# Altium project MobileRobot.PrjPcb
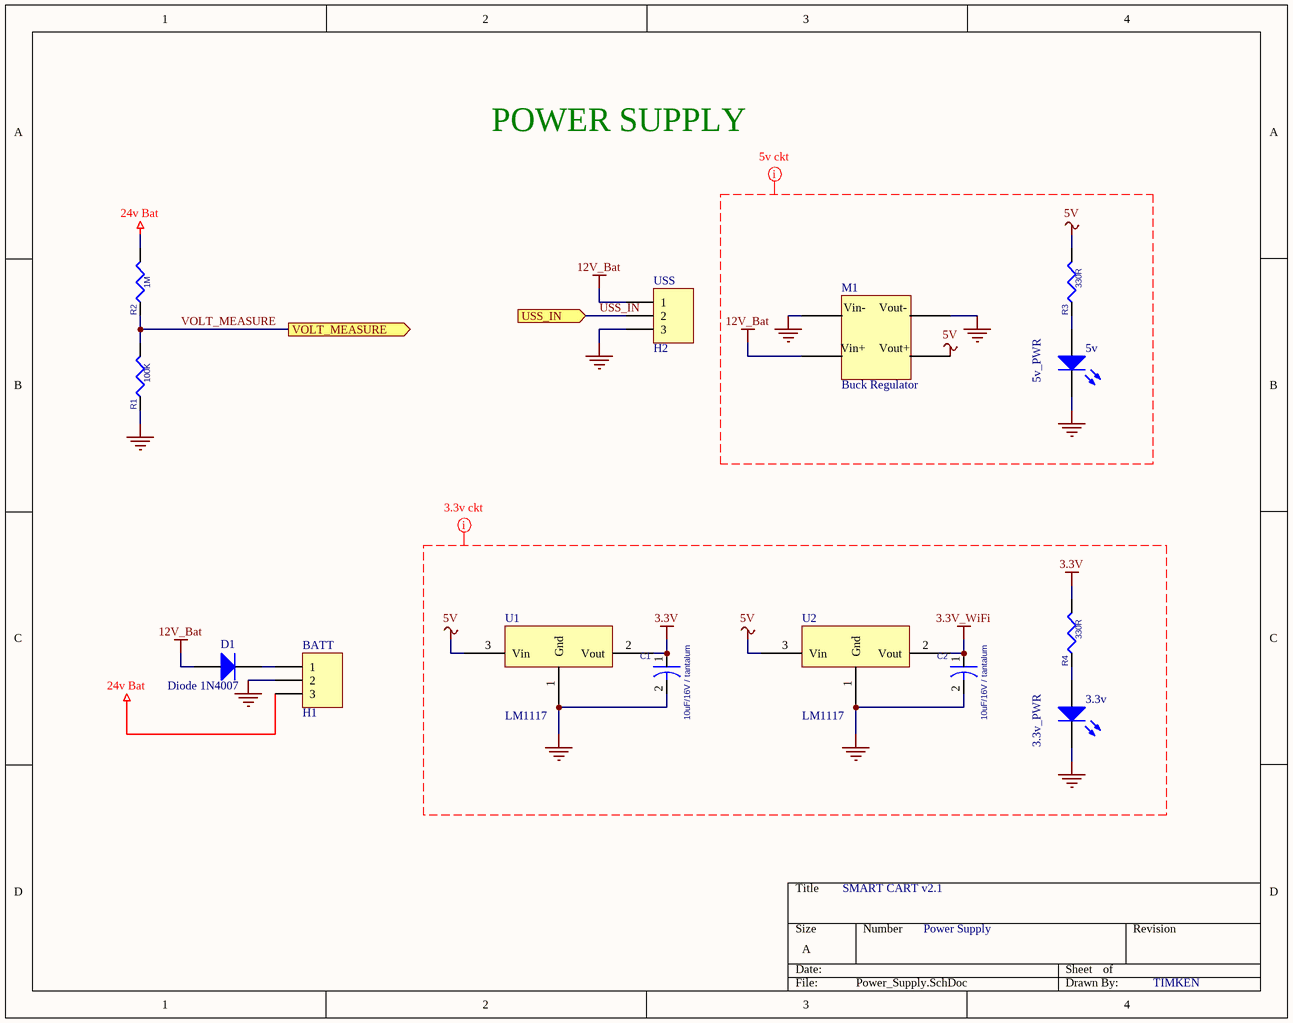
[diagram p0: Power_Supply.SchDoc]
7 sheets, 85 parts. Net scope: flat (ports and power ports of the same name join across sheets).
Board file: SmartCart_v2.1.PcbDoc
Sheets:
  Power_Supply.SchDoc
  Microcontroller.SchDoc
  Level_Shifter.SchDoc
  Debug.SchDoc
  LCD.SchDoc
  Memory.SchDoc
  Wifi.SchDoc

## Sheet Power_Supply.SchDoc
size A; Author: TIMKEN; CompanyName: TCS ROBOTICS; DrawnBy: TIMKEN; SheetNumber: 1; SheetTotal: 7; ProjectName: SMART CART v2.1

### Parts
3.3v  3.3v_PWR  [LED_SMD]
5v  5v_PWR  [LED_SMD]
BATT  H1  [BATTERY_3PIN]
C1  10uF/16V / tantalum  [CAP_TANTALUM]
C2  10uF/16V / tantalum  [1210]
D1  Diode 1N4007  [D-IN4007]
M1  Buck Regulator  [BUCKREGULATOR]
R1  100K  [RES_SMD]
R2  1M  [RES_SMD]
R3  330R  [RES_SMD]
R4  330R  [RES_SMD]
U1  LM1117  [LM1117]
U2  LM1117  [LM1117]
USS  H2  [1x3_single - duplicate]

### Ports
USS_IN (in), VOLT_MEASURE (out)

### Nets
3.3V: C1.1 R4.2 U1.2(Vout)
3.3V_WiFi: C2.1 U2.2(Vout)
5V: M1.Vout+ R3.2 U1.3(Vin) U2.3(Vin)
12V_Bat: D1.1(A) M1.Vin+ USS.1
24v Bat: BATT.3 R2.2
GND_POWER: 3.3v.2(K) 5v.2(K) BATT.2 C1.2 C2.2 M1.Vin- M1.Vout- R1.1 U1.1(Gnd) U2.1(Gnd) USS.3
USS_IN: USS.2 ; port USS_IN
VOLT_MEASURE: R1.2 R2.1 ; port VOLT_MEASURE
Net3.3v_1: 3.3v.1(A) R4.1
Net5v_1: 5v.1(A) R3.1
NetBATT_1: BATT.1 D1.2(K)

### Layout directives
rule Power Plane Clearance [Clearance = 20mil]: 3.3V, 3.3V_WiFi, 5V, 12V_Bat, GND_POWER

### Notes on the sheet
- POWER SUPPLY
- Power Supply

### Library data of the parts
3.3v 5v = LED_SMD: Typical INFRARED GaAs LED_throughole; Published: 8-Jun-2000; LatestRevisionDate: 08-Jul-2005; LatestRevisionNote: Mech Layer 1 removed.; PackageReference: LED-0; Publisher: Altium Limited; PackageDescription: LED; 2 Leads
BATT = BATTERY_3PIN: Header, 3-Pin
C1 C2 = C_0: M P No: TPSB106K016R0500; Vendor: Digikey; Descr: CAP TANT 10UF 16V 10% 1210,0.138" L x 0.110" W (3.50mm x 2.80mm); V P No: 478-5230-6-ND; Footprint: C1210
D1 = Diode 1N4007: 1 Amp General Purpose Rectifier; Published: 8-Jun-2000; LatestRevisionDate: 17-Jul-2002; LatestRevisionNote: Re-released for DXP Platform.; DatasheetVersion: 1998; PackageVersion: Aug-1999; PackageReference: DO-41; Publisher: Altium Limited; PackageDescription: Diode, Axial; Body 5.2 x 2.7 mm (LxDia. max), Lead Dia. 0.86 mm (max); Code_JEDEC: DO-204-AL; ComponentLink1Description: Manufacturer Link; ComponentLink1URL: http://www.fairchildsemi.com/; ComponentLink2Description: Datasheet; ComponentLink2URL: http://www.fairchildsemi.com/ds/1N%2F1N4001.pdf
M1 = Regulator: buck regulator\; XilinxEquivalent: CB4CLE; FunctionalClass: Counter; SubClass: Binary; ClockTrigger: Rising; Enable: High; Loadable: True; Reset: Asynchronous; PortSize: 4; PortType: Single Pin Version; ArchiveName: GENERIC; VHDLIB_SIM: GENERIC_LIB; Published: 29-Jan-2004; Publisher: Altium Limited; LastRevisionNo: 1.00.00; HelpURL: CR0118 FPGA Generic Library Guide.pdf#page=130; ComponentLink1URL: CR0130 FPGA Counter Resource Usage.pdf#page=18; ComponentLink1Description: Core &Resource Usage
R1-R4 = RESISTOR: Vendor: Digikey; Descr: RES 10K OHM 1/2W 5% 0805 SMD; V P No: P10KADTR-ND; M P No: ERJ-P06J103V; FootPrint: 0.079" L x 0.049" W (2.00mm x 1.25mm)  (0805 (2012 Metric)  )
USS = Header 3: Header, 3-Pin; LatestRevisionDate: 17-Jul-2002; LatestRevisionNote: Re-released for DXP Platform.; Publisher: Altium Limited

## Sheet Microcontroller.SchDoc
size C; DrawnBy: TIMKEN; SheetNumber: 2; SheetTotal: 7
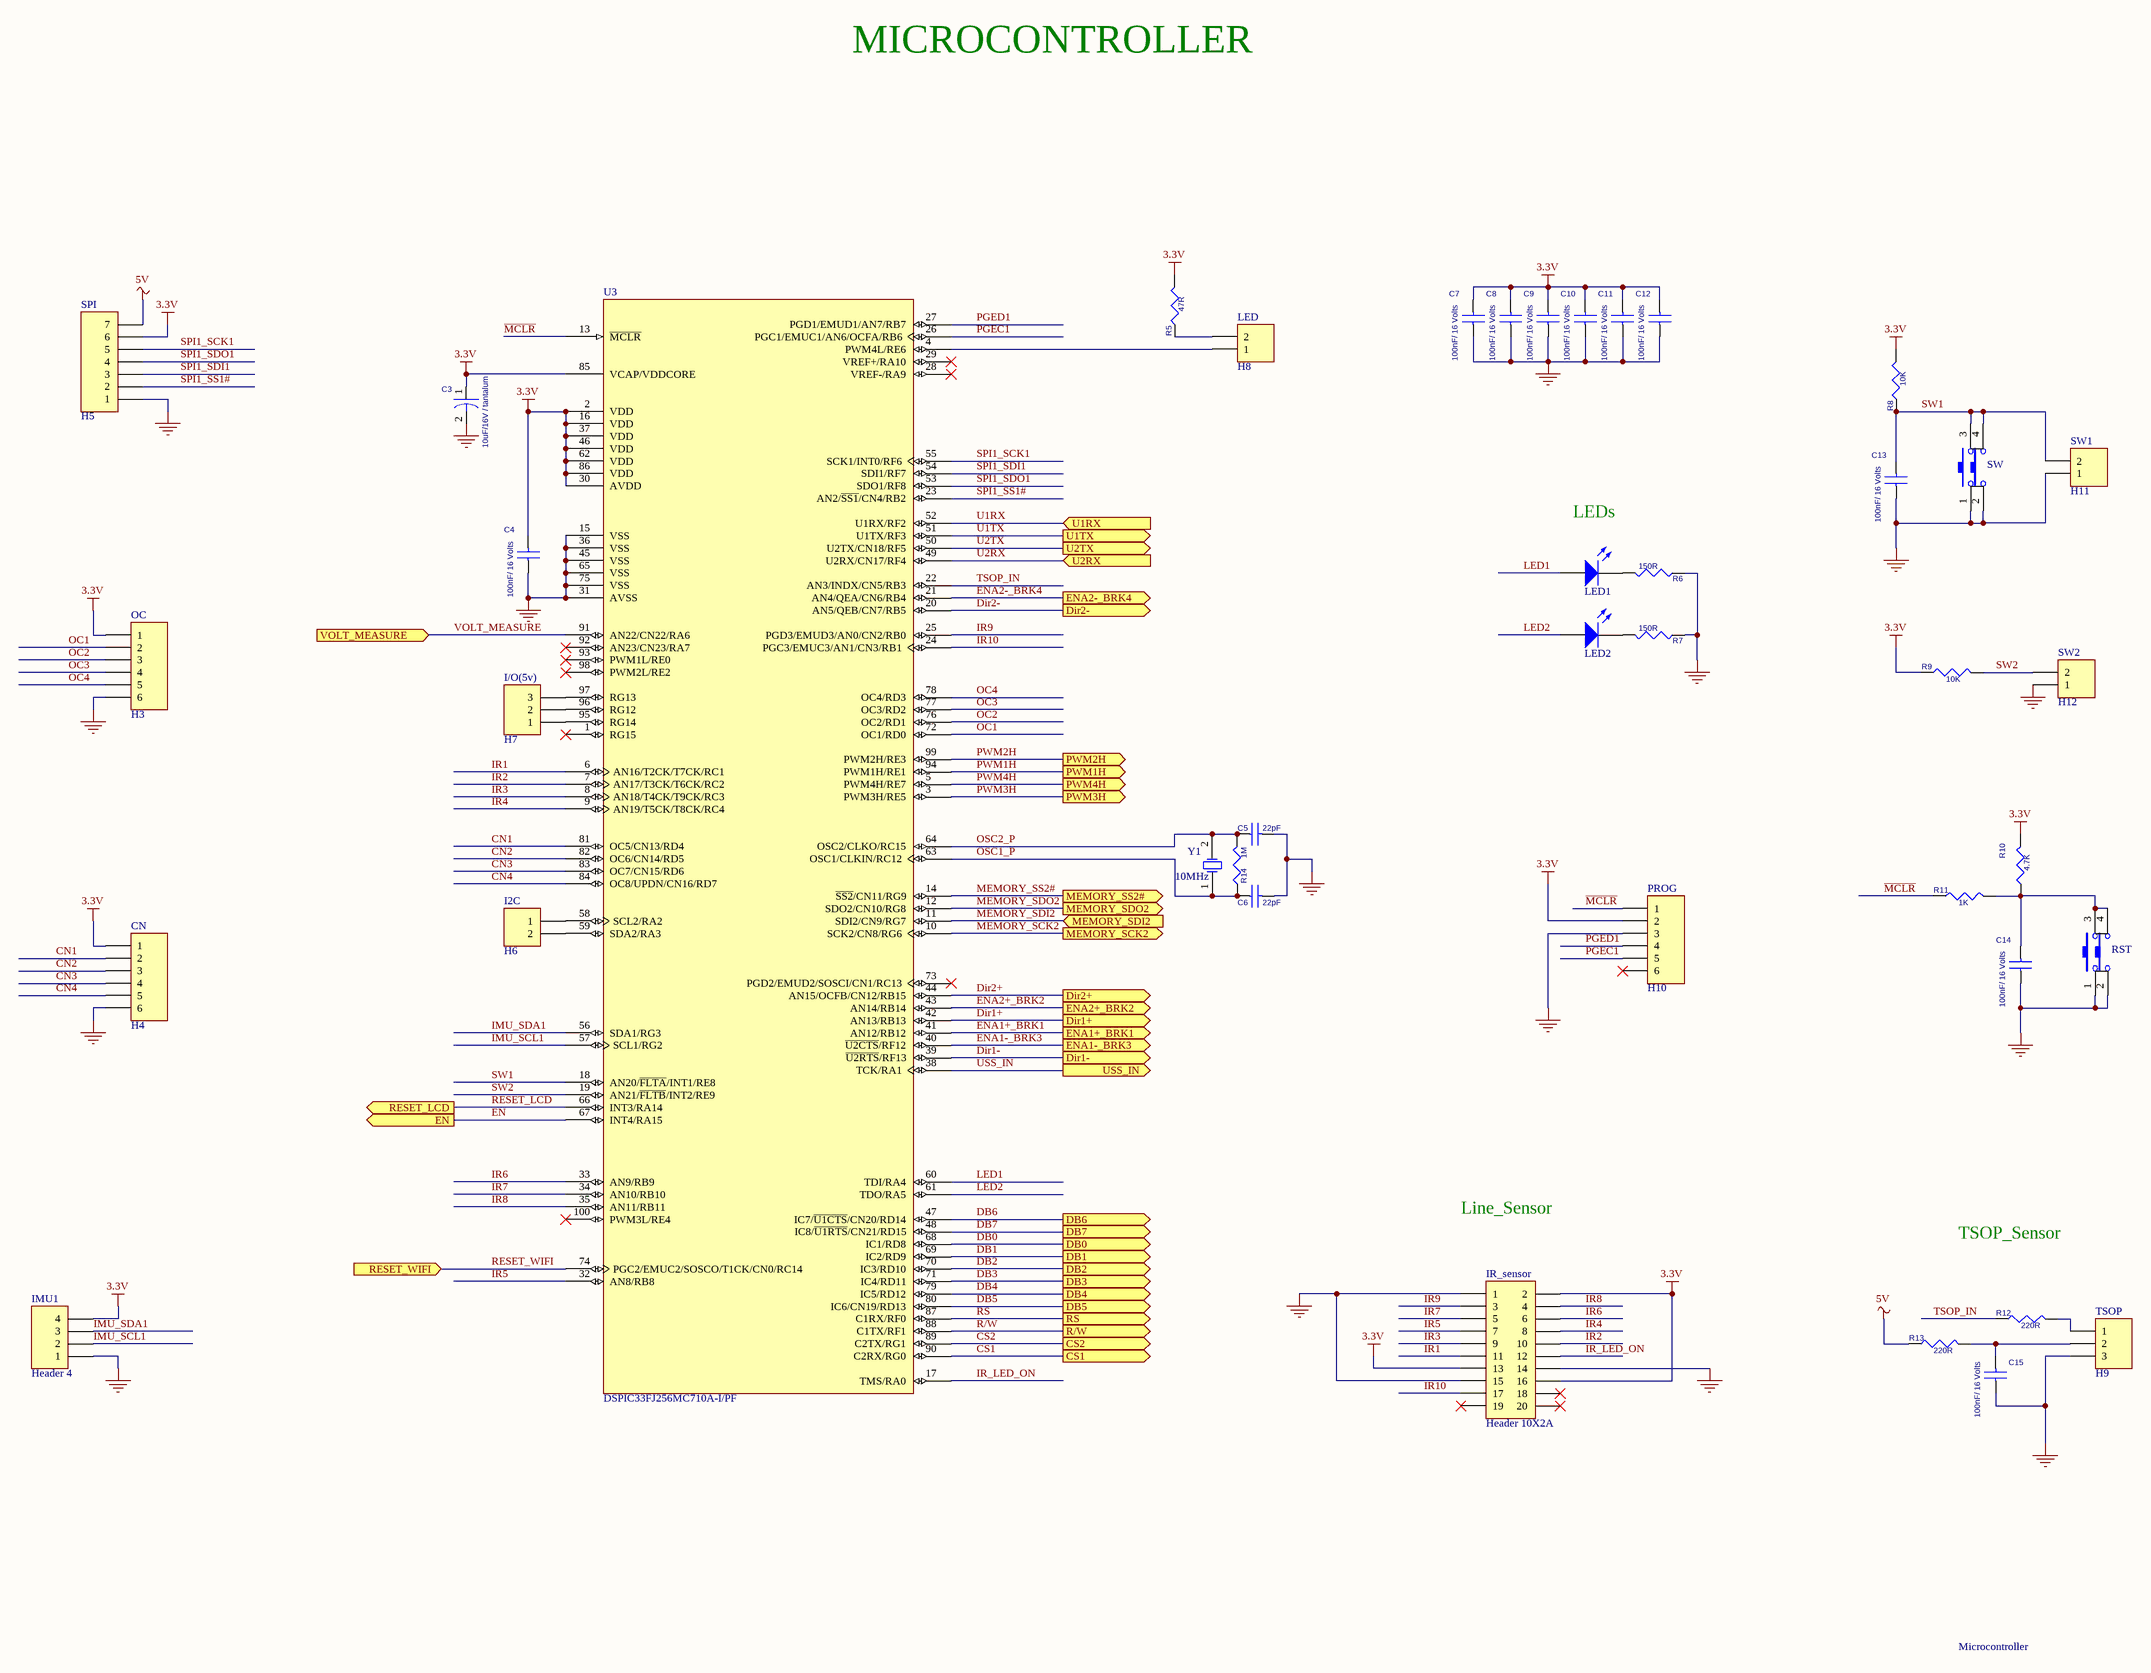
[diagram p1: Microcontroller.SchDoc]

### Parts
C3  10uF/16V / tantalum  [CAP_TANTALUM]
C4  100nF/ 16 Volts  [CAP_CERAMIC]
C5  22pF  [CAP_CERAMIC]
C6  22pF  [CAP_CERAMIC]
C7  100nF/ 16 Volts  [CAP_CERAMIC]
C8  100nF/ 16 Volts  [CAP_CERAMIC]
C9  100nF/ 16 Volts  [CAP_CERAMIC]
C10  100nF/ 16 Volts  [CAP_CERAMIC]
C11  100nF/ 16 Volts  [CAP_CERAMIC]
C12  100nF/ 16 Volts  [CAP_CERAMIC]
C13  100nF/ 16 Volts  [CAP_CERAMIC]
C14  100nF/ 16 Volts  [CAP_CERAMIC]
C15  100nF/ 16 Volts  [CAP_CERAMIC]
CN  H4  [1x6_single]
I2C  H6  [1x2_single]
I/O(5v)  H7  [1x3_single - duplicate]
IMU1  Header 4  [1x4_single]
IR_sensor  Header 10X2A  [10x2 row_ 2.54mm pitch]
LED  H8  [1x2_single]
LED1  LED1  [LED_SMD]  (value not drawn)
LED2  LED2  [LED_SMD]  (value not drawn)
OC  H3  [1x6_single]
PROG  H10  [1x6_single]
R5  47R  [RES_SMD]
R6  150R  [RES_SMD]
R7  150R  [RES_SMD]
R8  10K  [RES_SMD]
R9  10K  [RES_SMD]
R10  4.7K  [RES_SMD]
R11  1K  [RES_SMD]
R12  220R  [RES_SMD]
R13  220R  [RES_SMD]
R14  1M  [RES_SMD]
RST  SW-SMD  [SWITCH_SMD]  (value not drawn)
SPI  H5  [1x7_single]
SW  SW-SMD  [SWITCH_SMD]  (value not drawn)
SW1  H11  [1x2_single]
SW2  H12  [1x2_single]
TSOP  H9  [1x3_single - duplicate]
U3  DSPIC33FJ256MC710A-I/PF  [DSPIC33FJ256MC710-I/PF]
Y1  10MHz  [CRYSTAL_10MHZ]

### Ports
CS1 (out), CS2 (out), DB0 (out), DB1 (out), DB2 (out), DB3 (out), DB4 (out), DB5 (out), DB6 (out), DB7 (out), Dir1+ (out), Dir1- (out), Dir2+ (out), Dir2- (out), EN (out), ENA1+_BRK1 (out), ENA1-_BRK3 (out), ENA2+_BRK2 (out), ENA2-_BRK4 (out), MEMORY_SCK2 (out), MEMORY_SDI2 (in), MEMORY_SDO2 (out), MEMORY_SS2# (out), PWM1H (out), PWM2H (out), PWM3H (out), PWM4H (out), R/W (out), RESET_LCD (out), RESET_WIFI (in), RS (out), U1RX (in), U1TX (out), U2RX (in), U2TX (out), USS_IN (out), VOLT_MEASURE (in)

### Nets
3.3V: C3.1 C4.2 C7.2 C8.2 C9.2 C10.2 C11.2 C12.2 CN.1 IMU1.4 IR_sensor.2 IR_sensor.13 IR_sensor.16 OC.1 PROG.2 R5.2 R8.2 R9.1 R10.2 SPI.6 U3.2(VDD) U3.16(VDD) U3.30(AVDD) U3.37(VDD) U3.46(VDD) U3.62(VDD) U3.85(VCAP/VDDCORE) U3.86(VDD)
5V: R13.1 SPI.7
GND_POWER: C3.2 C4.1 C5.2 C6.2 C7.1 C8.1 C9.1 C10.1 C11.1 C12.1 C13.1 C14.1 C15.1 CN.6 IMU1.1 IR_sensor.1 IR_sensor.14 IR_sensor.15 OC.6 PROG.3 R6.1 R7.1 RST.1 RST.2 SPI.1 SW.1 SW.2 SW1.1 SW2.1 TSOP.3 U3.15(VSS) U3.31(AVSS) U3.36(VSS) U3.45(VSS) U3.65(VSS) U3.75(VSS)
CN1: CN.2 U3.81(OC5/CN13/RD4)
CN2: CN.3 U3.82(OC6/CN14/RD5)
CN3: CN.4 U3.83(OC7/CN15/RD6)
CN4: CN.5 U3.84(OC8/UPDN/CN16/RD7)
CS1: U3.90(C2RX/RG0) ; port CS1
CS2: U3.89(C2TX/RG1) ; port CS2
DB0: U3.68(IC1/RD8) ; port DB0
DB1: U3.69(IC2/RD9) ; port DB1
DB2: U3.70(IC3/RD10) ; port DB2
DB3: U3.71(IC4/RD11) ; port DB3
DB4: U3.79(IC5/RD12) ; port DB4
DB5: U3.80(IC6/CN19/RD13) ; port DB5
DB6: U3.47(IC7/~{U1CTS}/CN20/RD14) ; port DB6
DB7: U3.48(IC8/~{U1RTS}/CN21/RD15) ; port DB7
Dir1+: U3.42(AN13/RB13) ; port Dir1+
Dir1-: U3.39(~{U2RTS}/RF13) ; port Dir1-
Dir2+: U3.44(AN15/OCFB/CN12/RB15) ; port Dir2+
Dir2-: U3.20(AN5/QEB/CN7/RB5) ; port Dir2-
EN: U3.67(INT4/RA15) ; port EN
ENA1+_BRK1: U3.41(AN12/RB12) ; port ENA1+_BRK1
ENA1-_BRK3: U3.40(~{U2CTS}/RF12) ; port ENA1-_BRK3
ENA2+_BRK2: U3.43(AN14/RB14) ; port ENA2+_BRK2
ENA2-_BRK4: U3.21(AN4/QEA/CN6/RB4) ; port ENA2-_BRK4
IMU_SCL1: IMU1.2 U3.57(SCL1/RG2)
IMU_SDA1: IMU1.3 U3.56(SDA1/RG3)
IR1: IR_sensor.11 U3.6(AN16/T2CK/T7CK/RC1)
IR2: IR_sensor.10 U3.7(AN17/T3CK/T6CK/RC2)
IR3: IR_sensor.9 U3.8(AN18/T4CK/T9CK/RC3)
IR4: IR_sensor.8 U3.9(AN19/T5CK/T8CK/RC4)
IR5: IR_sensor.7 U3.32(AN8/RB8)
IR6: IR_sensor.6 U3.33(AN9/RB9)
IR7: IR_sensor.5 U3.34(AN10/RB10)
IR8: IR_sensor.4 U3.35(AN11/RB11)
IR9: IR_sensor.3 U3.25(PGD3/EMUD3/AN0/CN2/RB0)
IR10: IR_sensor.17 U3.24(PGC3/EMUC3/AN1/CN3/RB1)
IR_LED_ON: IR_sensor.12 U3.17(TMS/RA0)
LED1: LED1.1(A) U3.60(TDI/RA4)
LED2: LED2.1(A) U3.61(TDO/RA5)
~{MCLR}: PROG.1 R11.1 U3.13(~{MCLR})
MEMORY_SCK2: U3.10(SCK2/CN8/RG6) ; port MEMORY_SCK2
MEMORY_SDI2: U3.11(SDI2/CN9/RG7) ; port MEMORY_SDI2
MEMORY_SDO2: U3.12(SDO2/CN10/RG8) ; port MEMORY_SDO2
MEMORY_SS2#: U3.14(~{SS2}/CN11/RG9) ; port MEMORY_SS2#
OC1: OC.2 U3.72(OC1/RD0)
OC2: OC.3 U3.76(OC2/RD1)
OC3: OC.4 U3.77(OC3/RD2)
OC4: OC.5 U3.78(OC4/RD3)
OSC1_P: C6.1 R14.1 U3.63(OSC1/CLKIN/RC12) Y1.1(OSC1)
OSC2_P: C5.1 R14.2 U3.64(OSC2/CLKO/RC15) Y1.2(OSC2)
PGEC1: PROG.5 U3.26(PGC1/EMUC1/AN6/OCFA/RB6)
PGED1: PROG.4 U3.27(PGD1/EMUD1/AN7/RB7)
PWM1H: U3.94(PWM1H/RE1) ; port PWM1H
PWM2H: U3.99(PWM2H/RE3) ; port PWM2H
PWM3H: U3.3(PWM3H/RE5) ; port PWM3H
PWM4H: U3.5(PWM4H/RE7) ; port PWM4H
R/W: U3.88(C1TX/RF1) ; port R/W
RESET_LCD: U3.66(INT3/RA14) ; port RESET_LCD
RESET_WIFI: U3.74(PGC2/EMUC2/SOSCO/T1CK/CN0/RC14) ; port RESET_WIFI
RS: U3.87(C1RX/RF0) ; port RS
SPI1_SCK1: SPI.5 U3.55(SCK1/INT0/RF6)
SPI1_SDI1: SPI.3 U3.54(SDI1/RF7)
SPI1_SDO1: SPI.4 U3.53(SDO1/RF8)
SPI1_SS1#: SPI.2 U3.23(AN2/~{SS1}/CN4/RB2)
SW1: C13.2 R8.1 SW.3 SW.4 SW1.2 U3.18(AN20/~{FLTA}/INT1/RE8)
SW2: R9.2 SW2.2 U3.19(AN21/~{FLTB}/INT2/RE9)
TSOP_IN: R12.1 U3.22(AN3/INDX/CN5/RB3)
U1RX: U3.52(U1RX/RF2) ; port U1RX
U1TX: U3.51(U1TX/RF3) ; port U1TX
U2RX: U3.49(U2RX/CN17/RF4) ; port U2RX
U2TX: U3.50(U2TX/CN18/RF5) ; port U2TX
USS_IN: U3.38(TCK/RA1) ; port USS_IN
VOLT_MEASURE: U3.91(AN22/CN22/RA6) ; port VOLT_MEASURE
NetC14_2: C14.2 R10.1 R11.2 RST.3 RST.4
NetC15_2: C15.2 R13.2 TSOP.2
NetI2C_1: I2C.1 U3.58(SCL2/RA2)
NetI2C_2: I2C.2 U3.59(SDA2/RA3)
NetI/O(5v)_1: I/O(5v).1 U3.95(RG14)
NetI/O(5v)_2: I/O(5v).2 U3.96(RG12)
NetI/O(5v)_3: I/O(5v).3 U3.97(RG13)
NetLED1_2: LED1.2(K) R6.2
NetLED2_2: LED2.2(K) R7.2
NetLED_1: LED.1 U3.4(PWM4L/RE6)
NetLED_2: LED.2 R5.1
NetR12_2: R12.2 TSOP.1

Not connected (* = marked no-connect by the designer): IR_sensor 18* 19* 20*; PROG 6*; U3 1(RG15)* 28(VREF-/RA9)* 29(VREF+/RA10)* 73(PGD2/EMUD2/SOSCI/CN1/RC13)* 92(AN23/CN23/RA7)* 93(PWM1L/RE0)* 98(PWM2L/RE2)* 100(PWM3L/RE4)*

### Notes on the sheet
- MICROCONTROLLER
- LEDs
- Line_Sensor
- TSOP_Sensor
- Microcontroller

### Library data of the parts
C3 = C_0: as C1 on sheet Power_Supply; Footprint: C1210
C4-C15 = CAP NP: V P No: 644160RL; Vendor: Farnell; M P No: CC0805KRX7R7BB104; Descr: CAPACITOR, 0805, 100NF, 16V, X7R; FootPrint: C0805
CN OC PROG = Header 6: Header, 6-Pin; LatestRevisionDate: 17-Jul-2002; LatestRevisionNote: Re-released for DXP Platform.; Publisher: Altium Limited
I2C LED SW1 SW2 = Header 2: Header, 2-Pin; LatestRevisionDate: 17-Jul-2002; LatestRevisionNote: Re-released for DXP Platform.; Publisher: Altium Limited
I/O(5v) TSOP = Header 3: Header, 3-Pin; LatestRevisionDate: 17-Jul-2002; LatestRevisionNote: Re-released for DXP Platform.; Publisher: Altium Limited
IMU1 = Header 4: Header, 4-Pin; LatestRevisionDate: 17-Jul-2002; LatestRevisionNote: Re-released for DXP Platform.; Publisher: Altium Limited
IR_sensor = Header 10x2: Header, 20Pin, Dual row; LatestRevisionDate: 17-Jul-2002; LatestRevisionNote: Re-released for DXP Platform.; Publisher: Altium Limited
LED1 LED2 = LED_SMD: Typical INFRARED GaAs LED_throughole; Published: 8-Jun-2000; LatestRevisionDate: 08-Jul-2005; LatestRevisionNote: Mech Layer 1 removed.; PackageReference: LED-0; Publisher: Altium Limited; PackageDescription: LED; 2 Leads
R5-R14 = RESISTOR: as R1 on sheet Power_Supply; FootPrint: 0.079" L x 0.049" W (2.00mm x 1.25mm)  (0805 (2012 Metric)  )
RST SW = SW-SMD: Switch; V P No: SW836CT-ND; M P No: B3S-1000P; Vendor: Digikey; Descr: SWITCH TACTILE SPST-NO 0.05A 24V; Published: 24-Mar-1999; LatestRevisionDate: 17-Jul-2002; LatestRevisionNote: Re-released for DXP Platform.; PackageReference: SPST-2; Publisher: Altium Limited; PackageDescription: Switch; 2 Leads; FootPrint: 6.60mm x 6.00mm  Outlile(Refer Datasheet)
SPI = Header 7_1: Header, 6-Pin; LatestRevisionDate: 17-Jul-2002; LatestRevisionNote: Re-released for DXP Platform.; Publisher: Altium Limited
U3 = DSPIC33FJ256MC710-I/PF: High-Performance 16-bit Digital Signal Controller, 256 KB Flash, 30 KB RAM, 100-Pin TQFP, Industrial Temperature; Published: 29-Jan-2009; LatestRevisionDate: 02-Dec-2009; LatestRevisionNote: Updated to datasheet revision C, Mar-2009; DatasheetVersion: revC, Mar-2009; PackageVersion: revBB, Aug-2009; PackageReference: TQFP-PF100; Publisher: Altium Limited; PackageDescription: 100-Lead Thin Plastic Quad Flat Pack (PF) - 14x14x1mm Body, 2.00mm [TQFP]; Supplier 1: Digi-Key; Supplier Part Number 1: DSPIC33FJ256MC710-I/PF-ND; Supplier 2: Farnell; Supplier Part Number 2: 1332045; ComponentLink1Description: Datasheet; ComponentLink1URL: http://ww1.microchip.com/downloads/en/DeviceDoc/70287C.pdf; ComponentLink2Description: Packaging Specification; ComponentLink2URL: http://www.microchip.com/stellent/groups/techpub_sg/documents/packagingspec/en012702.pdf; ComponentLink3Description: Microchip.com Home; ComponentLink3URL: http://www.microchip.com/
Y1 = XTAL: Crystal Oscillator; Descr: Crystals 10MHz 20pF 30ppm -40C 85C; M P No: ECS-100-20-4X-DU; Vendor: Mouser; Published: 8-Jun-2000; LatestRevisionDate: 17-Jul-2002; LatestRevisionNote: Re-released for DXP Platform.; PackageReference: R38; Publisher: Altium Limited; FootPrint: 3.8 mm W x 11.1 mm L x 4.3 mm H; V P No: Crystals 10MHz 20pF 30ppm -40C 85C

## Sheet Level_Shifter.SchDoc
size A; DrawnBy: TIMKEN; SheetNumber: 3; SheetTotal: 7
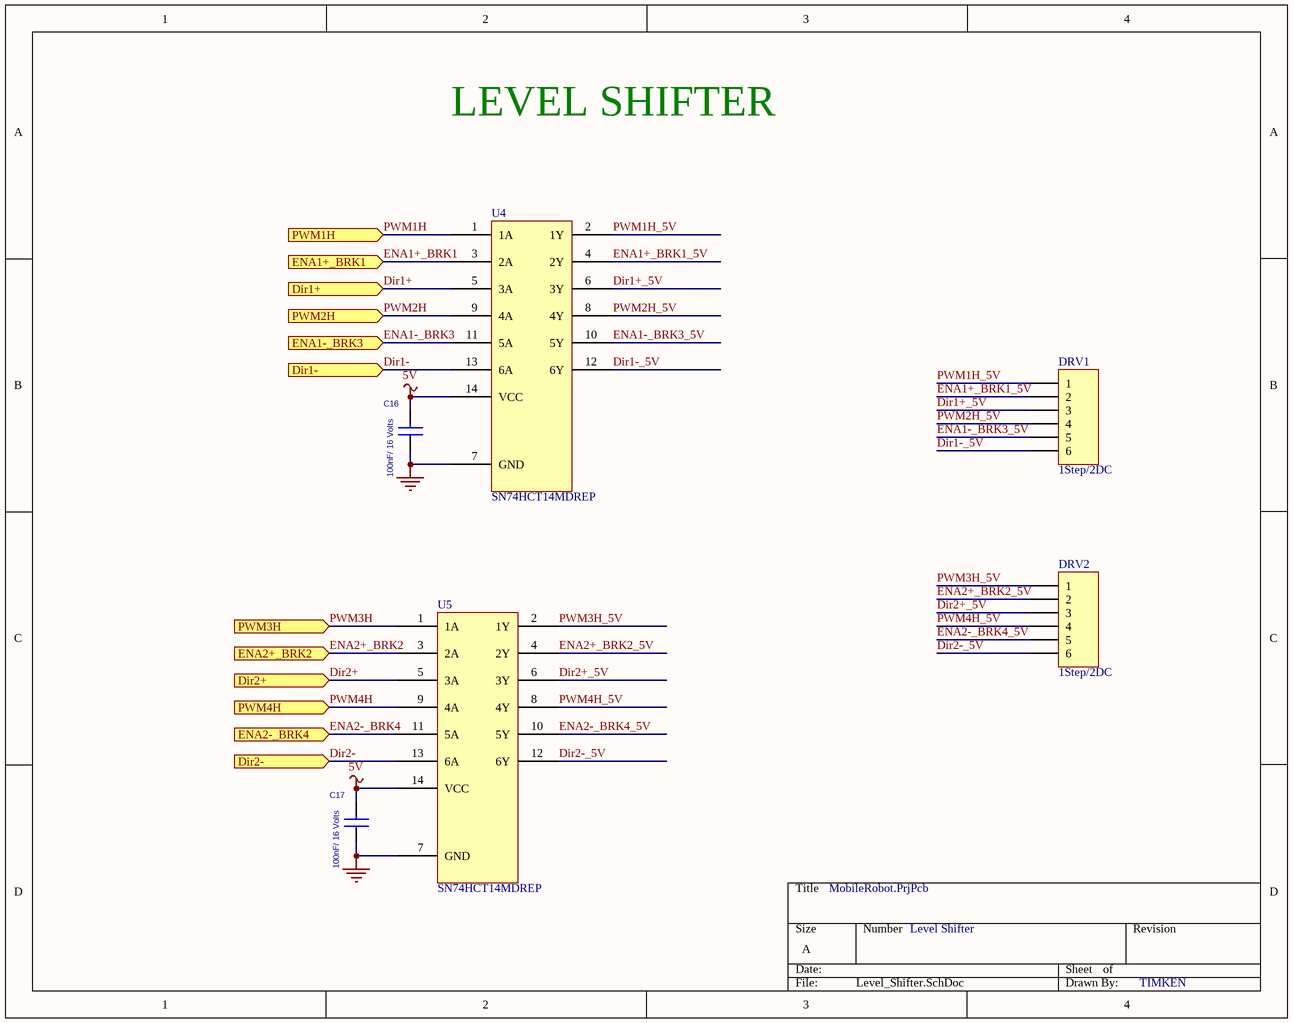
[diagram p2: Level_Shifter.SchDoc]

### Parts
C16  100nF/ 16 Volts  [CAP_CERAMIC]
C17  100nF/ 16 Volts  [CAP_CERAMIC]
DRV1  1Step/2DC  [1x6_single]
DRV2  1Step/2DC  [1x6_single]
U4  SN74HCT14MDREP  [SN74HCT14MDREP]
U5  SN74HCT14MDREP  [SN74HCT14MDREP]

### Ports
Dir1+ (in), Dir1- (in), Dir2+ (in), Dir2- (in), ENA1+_BRK1 (in), ENA1-_BRK3 (in), ENA2+_BRK2 (in), ENA2-_BRK4 (in), PWM1H (in), PWM2H (in), PWM3H (in), PWM4H (in)

### Nets
5V: C16.2 C17.2 U4.14(VCC) U5.14(VCC)
GND_POWER: C16.1 C17.1 U4.7(GND) U5.7(GND)
Dir1+: U4.5(3A) ; port Dir1+
Dir1+_5V: DRV1.3 U4.6(3Y)
Dir1-: U4.13(6A) ; port Dir1-
Dir1-_5V: DRV1.6 U4.12(6Y)
Dir2+: U5.5(3A) ; port Dir2+
Dir2+_5V: DRV2.3 U5.6(3Y)
Dir2-: U5.13(6A) ; port Dir2-
Dir2-_5V: DRV2.6 U5.12(6Y)
ENA1+_BRK1: U4.3(2A) ; port ENA1+_BRK1
ENA1+_BRK1_5V: DRV1.2 U4.4(2Y)
ENA1-_BRK3: U4.11(5A) ; port ENA1-_BRK3
ENA1-_BRK3_5V: DRV1.5 U4.10(5Y)
ENA2+_BRK2: U5.3(2A) ; port ENA2+_BRK2
ENA2+_BRK2_5V: DRV2.2 U5.4(2Y)
ENA2-_BRK4: U5.11(5A) ; port ENA2-_BRK4
ENA2-_BRK4_5V: DRV2.5 U5.10(5Y)
PWM1H: U4.1(1A) ; port PWM1H
PWM1H_5V: DRV1.1 U4.2(1Y)
PWM2H: U4.9(4A) ; port PWM2H
PWM2H_5V: DRV1.4 U4.8(4Y)
PWM3H: U5.1(1A) ; port PWM3H
PWM3H_5V: DRV2.1 U5.2(1Y)
PWM4H: U5.9(4A) ; port PWM4H
PWM4H_5V: DRV2.4 U5.8(4Y)

### Notes on the sheet
- LEVEL SHIFTER
- Level Shifter

### Library data of the parts
C16 C17 = CAP NP: as C4 on sheet Microcontroller; FootPrint: C0805
DRV1 DRV2 = Header 6: Header, 6-Pin; LatestRevisionDate: 17-Jul-2002; LatestRevisionNote: Re-released for DXP Platform.; Publisher: Altium Limited
U4 U5 = 74HC153D

## Sheet Debug.SchDoc
size A; DrawnBy: TIMKEN; SheetNumber: 4; SheetTotal: 7
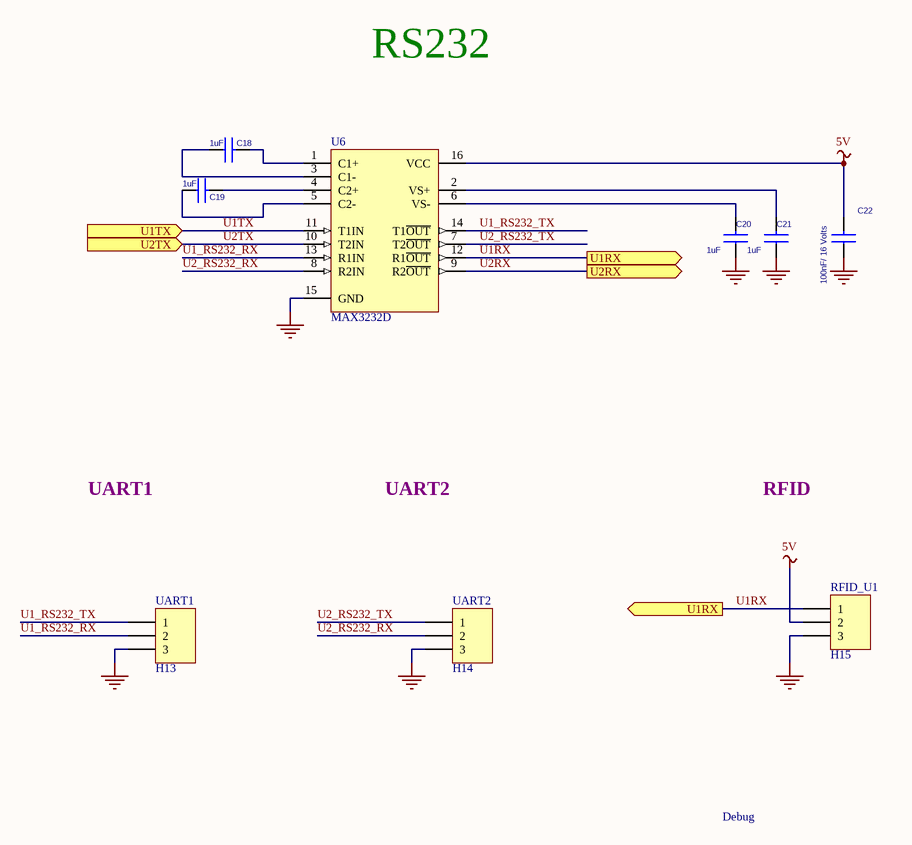
[diagram p3: Debug.SchDoc]

### Parts
C18  1uF  [CAP_CERAMIC]
C19  1uF  [CAP_CERAMIC]
C20  1uF  [CAP_CERAMIC]
C21  1uF  [CAP_CERAMIC]
C22  100nF/ 16 Volts  [CAP_CERAMIC]
RFID_U1  H15  [1x3_single - duplicate]
U6  MAX3232D  [MAX232D]
UART1  H13  [1x3_single - duplicate]
UART2  H14  [1x3_single - duplicate]

### Ports
U1RX (out), U1TX (in), U2RX (out), U2TX (in)

### Nets
5V: C22.2 RFID_U1.2 U6.16(VCC)
GND_POWER: C20.1 C21.1 C22.1 RFID_U1.3 U6.15(GND) UART1.3 UART2.3
U1_RS232_RX: U6.13(R1IN) UART1.2
U1_RS232_TX: U6.14(T1~{OUT}) UART1.1
U1RX: RFID_U1.1 U6.12(R1~{OUT}) ; port U1RX
U1TX: U6.11(T1IN) ; port U1TX
U2_RS232_RX: U6.8(R2IN) UART2.2
U2_RS232_TX: U6.7(T2~{OUT}) UART2.1
U2RX: U6.9(R2~{OUT}) ; port U2RX
U2TX: U6.10(T2IN) ; port U2TX
NetC18_1: C18.1 U6.3(C1-)
NetC18_2: C18.2 U6.1(C1+)
NetC19_1: C19.1 U6.5(C2-)
NetC19_2: C19.2 U6.4(C2+)
NetC20_2: C20.2 U6.6(VS-)
NetC21_2: C21.2 U6.2(VS+)

### Notes on the sheet
- RS232
- UART1
- UART2
- RFID
- Debug

### Library data of the parts
C18-C22 = CAP NP: as C4 on sheet Microcontroller; FootPrint: C0805
RFID_U1 UART1 UART2 = Header 3: Header, 3-Pin; LatestRevisionDate: 17-Jul-2002; LatestRevisionNote: Re-released for DXP Platform.; Publisher: Altium Limited
U6 = MAX232D: Dual EIA-232 Driver/Receiver; Note: Receivers have typical hysteresis of 0.5V; Published: 15-May-2002; LatestRevisionDate: 13-Apr-2006; LatestRevisionNote: IPC-7351 Footprint Added.; DatasheetVersion: Jun-1989; PackageVersion: Jan-1998; PackageReference: D016; Publisher: Altium Limited; PackageDescription: 16-Pin Small Outline Integrated Circuit 1.27 mm Pitch; Code_IPC: SOIC127P600-16; ComponentLink1Description: Manufacturer Link; ComponentLink1URL: http://www.ti.com/; ComponentLink2Description: Datasheet; ComponentLink2URL: http://www-s.ti.com/sc/ds/max232.pdf

## Sheet LCD.SchDoc
size A; DrawnBy: TIMKEN; SheetNumber: 5; SheetTotal: 7
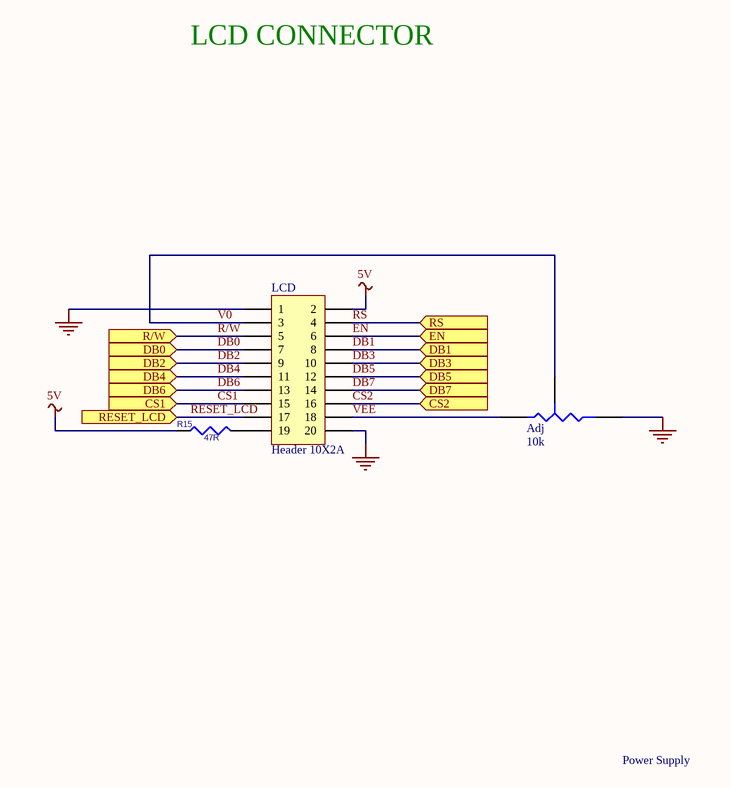
[diagram p4: LCD.SchDoc]

### Parts
Adj  value 10k  [Pot 3pin]  (hidden comment: RES_POT)
LCD  Header 10X2A  [10x2 row_ 2.54mm pitch]
R15  47R  [RES_SMD]

### Ports
CS1 (in), CS2 (in), DB0 (in), DB1 (in), DB2 (in), DB3 (in), DB4 (in), DB5 (in), DB6 (in), DB7 (in), EN (in), R/W (in), RESET_LCD (in), RS (in)

### Nets
5V: LCD.2 R15.1
GND_POWER: Adj.3(B) LCD.1 LCD.20
CS1: LCD.15 ; port CS1
CS2: LCD.16 ; port CS2
DB0: LCD.7 ; port DB0
DB1: LCD.8 ; port DB1
DB2: LCD.9 ; port DB2
DB3: LCD.10 ; port DB3
DB4: LCD.11 ; port DB4
DB5: LCD.12 ; port DB5
DB6: LCD.13 ; port DB6
DB7: LCD.14 ; port DB7
EN: LCD.6 ; port EN
R/W: LCD.5 ; port R/W
RESET_LCD: LCD.17 ; port RESET_LCD
RS: LCD.4 ; port RS
V0: Adj.2(TAP) LCD.3
VEE: Adj.1(A) LCD.18
NetLCD_19: LCD.19 R15.2

### Notes on the sheet
- LCD CONNECTOR
- Power Supply

### Library data of the parts
Adj = RES_POT: Tapped Resistor; Sim Note: Enter the Resistance value and the set point into parameter fields.; Set Position: 0.5; Published: 24-Mar-1999; LatestRevisionDate: 17-Jul-2002; LatestRevisionNote: Re-released for DXP Platform.; PackageReference: VR3; Publisher: Altium Limited; PackageDescription: Variable Resistor, Thru-Hole; 3 Leads
LCD = Header 10x2: Header, 20Pin, Dual row; LatestRevisionDate: 17-Jul-2002; LatestRevisionNote: Re-released for DXP Platform.; Publisher: Altium Limited
R15 = RESISTOR: as R1 on sheet Power_Supply; FootPrint: 0.079" L x 0.049" W (2.00mm x 1.25mm)  (0805 (2012 Metric)  )

## Sheet Memory.SchDoc
size A; DrawnBy: TIMKEN; SheetNumber: 6; SheetTotal: 7
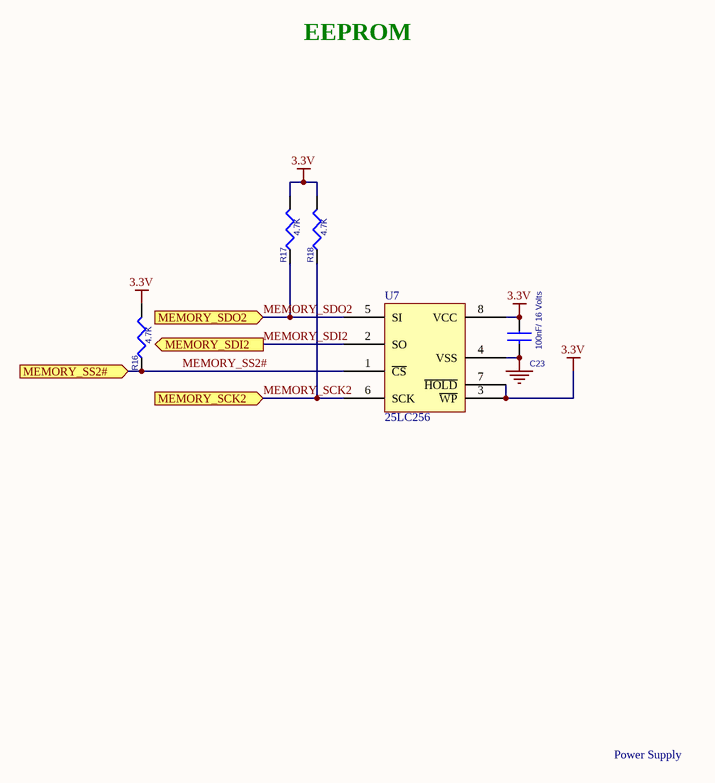
[diagram p5: Memory.SchDoc]

### Parts
C23  100nF/ 16 Volts  [CAP_CERAMIC]
R16  4.7K  [RES_SMD]
R17  4.7K  [RES_SMD]
R18  4.7K  [RES_SMD]
U7  25LC256  [25LC256]

### Ports
MEMORY_SCK2 (in), MEMORY_SDI2 (out), MEMORY_SDO2 (in), MEMORY_SS2# (in)

### Nets
3.3V: C23.1 R16.2 R17.2 R18.2 U7.3(~{WP}) U7.7(~{HOLD}) U7.8(VCC)
GND_POWER: C23.2 U7.4(VSS)
MEMORY_SCK2: R18.1 U7.6(SCK) ; port MEMORY_SCK2
MEMORY_SDI2: U7.2(SO) ; port MEMORY_SDI2
MEMORY_SDO2: R17.1 U7.5(SI) ; port MEMORY_SDO2
MEMORY_SS2#: R16.1 U7.1(~{CS}) ; port MEMORY_SS2#

### Notes on the sheet
- EEPROM
- Power Supply

### Library data of the parts
C23 = CAP NP: as C4 on sheet Microcontroller; FootPrint: C0805
R16-R18 = RESISTOR: as R1 on sheet Power_Supply; FootPrint: 0.079" L x 0.049" W (2.00mm x 1.25mm)  (0805 (2012 Metric)  )
U7 = 25LC256: V P No: 25LC256-I/SN-ND; Vendor: Digikey; Descr: IC EEPROM 256KBIT 10MHZ 8SOIC; M P No: 25LC256-I/SN; 25LC256: *; FootPrint: 8-SOIC (0.154", 3.90mm Width); Price: 1.39000

## Sheet Wifi.SchDoc
size A; DrawnBy: TIMKEN; SheetNumber: 7; SheetTotal: 7
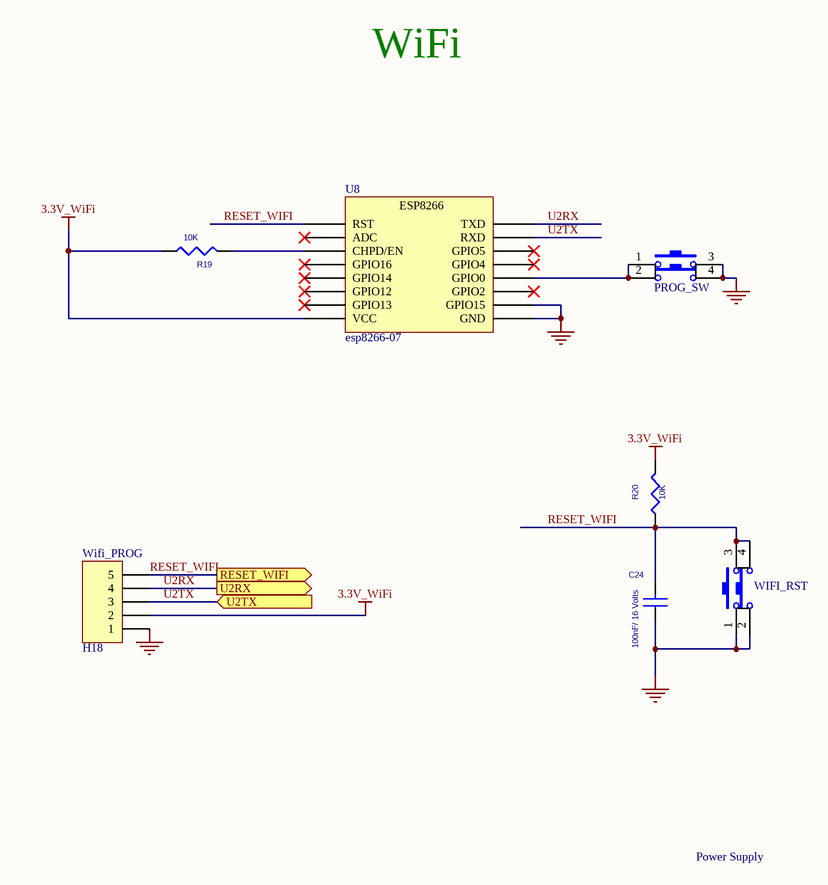
[diagram p6: Wifi.SchDoc]

### Parts
C24  100nF/ 16 Volts  [CAP_CERAMIC]
PROG_SW  SW-SMD  [SWITCH_SMD]  (value not drawn)
R19  10K  [RES_SMD]
R20  10K  [RES_SMD]
U8  esp8266-07  [esp8266-07]
Wifi_PROG  H18  [1x5_single]
WIFI_RST  SW-SMD  [SWITCH_SMD]  (value not drawn)

### Ports
RESET_WIFI (out), U2RX (out), U2TX (in)

### Nets
3.3V_WiFi: R19.1 R20.2 U8.7(VCC) Wifi_PROG.2
GND_POWER: C24.1 PROG_SW.3 PROG_SW.4 U8.8(GND) U8.9(GPIO15) Wifi_PROG.1 WIFI_RST.1 WIFI_RST.2
RESET_WIFI: C24.2 R20.1 U8.0(RST) Wifi_PROG.5 WIFI_RST.3 WIFI_RST.4 ; port RESET_WIFI
U2RX: U8.15(TXD) Wifi_PROG.4 ; port U2RX
U2TX: U8.14(RXD) Wifi_PROG.3 ; port U2TX
NetPROG_SW_1: PROG_SW.1 PROG_SW.2 U8.11(GPIO0)
NetR19_2: R19.2 U8.2(CHPD/EN)

Not connected (* = marked no-connect by the designer): U8 1(ADC)* 3(GPIO16)* 4(GPIO14)* 5(GPIO12)* 6(GPIO13)* 10(GPIO2)* 12(GPIO4)* 13(GPIO5)*

### Notes on the sheet
- WiFi
- Power Supply
- (in symbol esp8266-07) ESP8266 /

### Library data of the parts
C24 = CAP NP: as C4 on sheet Microcontroller; FootPrint: C0805
PROG_SW WIFI_RST = SW-SMD: as RST on sheet Microcontroller; Published: 24-Mar-1999; LatestRevisionDate: 17-Jul-2002; LatestRevisionNote: Re-released for DXP Platform.; PackageReference: SPST-2; Publisher: Altium Limited; PackageDescription: Switch; 2 Leads; FootPrint: 6.60mm x 6.00mm  Outlile(Refer Datasheet)
R19 R20 = RESISTOR: as R1 on sheet Power_Supply; FootPrint: 0.079" L x 0.049" W (2.00mm x 1.25mm)  (0805 (2012 Metric)  )
U8 = esp8266-07: 4-Bit Loadable Cascadable Binary Counter with Clock Enable and Asynchronous Clear, Single Pin Version; XilinxEquivalent: CB4CLE; ClockTrigger: Rising; Enable: High; Loadable: True; PortSize: 4; ArchiveName: GENERIC; VHDLIB_SIM: GENERIC_LIB; Published: 29-Jan-2004; Publisher: Altium Limited; LastRevisionNo: 1.00.00; HelpURL: CR0118 FPGA Generic Library Guide.pdf#page=130; ComponentLink1URL: CR0130 FPGA Counter Resource Usage.pdf#page=18; ComponentLink1Description: Core &Resource Usage; FunctionalClass: Counter; SubClass: Binary; Reset: Asynchronous; PortType: Single Pin Version
Wifi_PROG = Header 5: Header, 5-Pin; LatestRevisionDate: 17-Jul-2002; LatestRevisionNote: Re-released for DXP Platform.; Publisher: Altium Limited

## Nets that join several sheets
3.3V: Power_Supply (C1.1 R4.2 U1.2), Microcontroller (28 pins), Memory (7 pins)
3.3V_WiFi: Power_Supply (C2.1 U2.2), Wifi (R19.1 R20.2 U8.7 Wifi_PROG.2)
5V: Power_Supply (M1.Vout+ R3.2 U1.3 U2.3), Microcontroller (R13.1 SPI.7), Level_Shifter (C16.2 C17.2 U4.14 U5.14), Debug (C22.2 RFID_U1.2 U6.16), LCD (LCD.2 R15.1)
GND_POWER: Power_Supply (11 pins), Microcontroller (36 pins), Level_Shifter (C16.1 C17.1 U4.7 U5.7), Debug (7 pins), LCD (Adj.3 LCD.1 LCD.20), Memory (C23.2 U7.4), Wifi (8 pins)
CS1: Microcontroller (U3.90), LCD (LCD.15)
CS2: Microcontroller (U3.89), LCD (LCD.16)
DB0: Microcontroller (U3.68), LCD (LCD.7)
DB1: Microcontroller (U3.69), LCD (LCD.8)
DB2: Microcontroller (U3.70), LCD (LCD.9)
DB3: Microcontroller (U3.71), LCD (LCD.10)
DB4: Microcontroller (U3.79), LCD (LCD.11)
DB5: Microcontroller (U3.80), LCD (LCD.12)
DB6: Microcontroller (U3.47), LCD (LCD.13)
DB7: Microcontroller (U3.48), LCD (LCD.14)
Dir1+: Microcontroller (U3.42), Level_Shifter (U4.5)
Dir1-: Microcontroller (U3.39), Level_Shifter (U4.13)
Dir2+: Microcontroller (U3.44), Level_Shifter (U5.5)
Dir2-: Microcontroller (U3.20), Level_Shifter (U5.13)
EN: Microcontroller (U3.67), LCD (LCD.6)
ENA1+_BRK1: Microcontroller (U3.41), Level_Shifter (U4.3)
ENA1-_BRK3: Microcontroller (U3.40), Level_Shifter (U4.11)
ENA2+_BRK2: Microcontroller (U3.43), Level_Shifter (U5.3)
ENA2-_BRK4: Microcontroller (U3.21), Level_Shifter (U5.11)
MEMORY_SCK2: Microcontroller (U3.10), Memory (R18.1 U7.6)
MEMORY_SDI2: Microcontroller (U3.11), Memory (U7.2)
MEMORY_SDO2: Microcontroller (U3.12), Memory (R17.1 U7.5)
MEMORY_SS2#: Microcontroller (U3.14), Memory (R16.1 U7.1)
PWM1H: Microcontroller (U3.94), Level_Shifter (U4.1)
PWM2H: Microcontroller (U3.99), Level_Shifter (U4.9)
PWM3H: Microcontroller (U3.3), Level_Shifter (U5.1)
PWM4H: Microcontroller (U3.5), Level_Shifter (U5.9)
R/W: Microcontroller (U3.88), LCD (LCD.5)
RESET_LCD: Microcontroller (U3.66), LCD (LCD.17)
RESET_WIFI: Microcontroller (U3.74), Wifi (6 pins)
RS: Microcontroller (U3.87), LCD (LCD.4)
U1RX: Microcontroller (U3.52), Debug (RFID_U1.1 U6.12)
U1TX: Microcontroller (U3.51), Debug (U6.11)
U2RX: Microcontroller (U3.49), Debug (U6.9), Wifi (U8.15 Wifi_PROG.4)
U2TX: Microcontroller (U3.50), Debug (U6.10), Wifi (U8.14 Wifi_PROG.3)
USS_IN: Power_Supply (USS.2), Microcontroller (U3.38)
VOLT_MEASURE: Power_Supply (R1.2 R2.1), Microcontroller (U3.91)